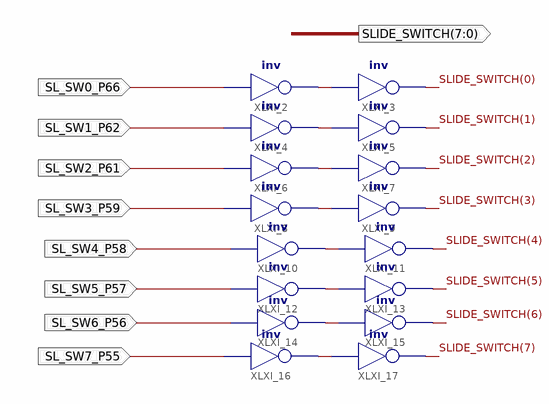
[diagram p0: schematic sheet 1]
// Xilinx ISE schematic slideswitch.sch (spartan6) as structural Verilog: 16 symbols, 9 ports
module slideswitch (
  input  SL_SW0_P66,
  input  SL_SW1_P62,
  input  SL_SW2_P61,
  input  SL_SW3_P59,
  input  SL_SW4_P58,
  input  SL_SW5_P57,
  input  SL_SW6_P56,
  input  SL_SW7_P55,
  output [7:0] SLIDE_SWITCH
);

  wire XLXN_12, XLXN_13, XLXN_14, XLXN_15, XLXN_16, XLXN_22, XLXN_24, XLXN_25;

  not XLXI_2 (XLXN_12, SL_SW0_P66);
  not XLXI_3 (SLIDE_SWITCH[0], XLXN_12);
  not XLXI_4 (XLXN_13, SL_SW1_P62);
  not XLXI_5 (SLIDE_SWITCH[1], XLXN_13);
  not XLXI_6 (XLXN_14, SL_SW2_P61);
  not XLXI_7 (SLIDE_SWITCH[2], XLXN_14);
  not XLXI_8 (XLXN_15, SL_SW3_P59);
  not XLXI_9 (SLIDE_SWITCH[3], XLXN_15);
  not XLXI_10 (XLXN_16, SL_SW4_P58);
  not XLXI_11 (SLIDE_SWITCH[4], XLXN_16);
  not XLXI_12 (XLXN_22, SL_SW5_P57);
  not XLXI_13 (SLIDE_SWITCH[5], XLXN_22);
  not XLXI_14 (XLXN_24, SL_SW6_P56);
  not XLXI_15 (SLIDE_SWITCH[6], XLXN_24);
  not XLXI_16 (XLXN_25, SL_SW7_P55);
  not XLXI_17 (SLIDE_SWITCH[7], XLXN_25);
endmodule
